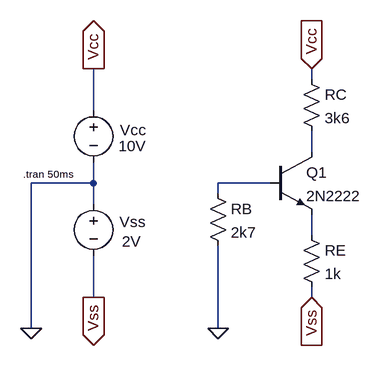
[diagram p0: schematic PEFD-polarizaca-de-emissor-por-fonte-dupla.asc]
PEFD-polarizaca-de-emissor-por-fonte-dupla.asc, the LTspice schematic file:
Version 4
SHEET 1 880 680
WIRE 464 -32 464 -48
WIRE 128 16 128 -48
WIRE 464 80 464 48
WIRE 128 128 128 96
WIRE 128 128 32 128
WIRE 400 128 320 128
WIRE 320 144 320 128
WIRE 128 160 128 128
WIRE 464 208 464 176
WIRE 128 304 128 240
WIRE 464 304 464 288
WIRE 32 352 32 128
WIRE 320 352 320 224
FLAG 32 352 0
FLAG 320 352 0
FLAG 128 -48 Vcc
IOPIN 128 -48 Out
FLAG 128 304 Vss
IOPIN 128 304 Out
FLAG 464 -48 Vcc
IOPIN 464 -48 In
FLAG 464 304 Vss
IOPIN 464 304 In
SYMBOL voltage 128 0 R0
WINDOW 0 41 46 Left 2
WINDOW 3 39 71 Left 2
WINDOW 123 0 0 Left 0
WINDOW 39 0 0 Left 0
SYMATTR InstName Vcc
SYMATTR Value 10V
SYMBOL voltage 128 144 R0
WINDOW 0 40 44 Left 2
WINDOW 3 44 74 Left 2
WINDOW 123 0 0 Left 0
WINDOW 39 0 0 Left 0
SYMATTR InstName Vss
SYMATTR Value 2V
SYMBOL res 304 128 R0
SYMATTR InstName RB
SYMATTR Value 2k7
SYMBOL res 448 -48 R0
SYMATTR InstName RC
SYMATTR Value 3k6
SYMBOL res 448 192 R0
SYMATTR InstName RE
SYMATTR Value 1k
SYMBOL npn 400 80 R0
SYMATTR InstName Q1
SYMATTR Value 2N2222
TEXT 20 114 Left 1 !.tran 50ms

The netlist it stands for:
* PEFD-polarizaca-de-emissor-por-fonte-dupla.asc
Vcc Vcc 0 10V
Vss 0 Vss 2V
RB N002 0 2k7
RC Vcc N001 3k6
RE N003 Vss 1k
Q1 N001 N002 N003 0 2N2222
.model NPN NPN
.model PNP PNP
.lib standard.bjt
.tran 50ms
.backanno
.end